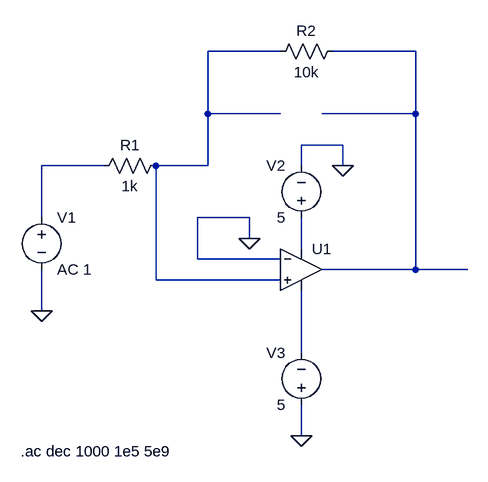
[diagram p0: schematic low-gain-amp-with-out_C_v3.asc]
low-gain-amp-with-out_C_v3.asc, the LTspice schematic file:
Version 4
SHEET 1 880 680
WIRE 272 -112 160 -112
WIRE 480 -112 352 -112
WIRE 160 -16 160 -112
WIRE 272 -16 160 -16
WIRE 480 -16 480 -112
WIRE 480 -16 336 -16
WIRE 368 32 304 32
WIRE 0 64 -96 64
WIRE 160 64 160 -16
WIRE 160 64 80 64
WIRE 304 64 304 32
WIRE 368 64 368 32
WIRE -96 144 -96 64
WIRE 224 144 144 144
WIRE 224 176 224 144
WIRE 304 192 304 144
WIRE 144 208 144 144
WIRE 272 208 144 208
WIRE 480 224 480 -16
WIRE 480 224 336 224
WIRE 560 224 480 224
WIRE 80 240 80 64
WIRE 272 240 80 240
WIRE -96 288 -96 224
WIRE 304 352 304 256
WIRE 304 480 304 432
FLAG 304 480 0
FLAG 368 64 0
FLAG 224 176 0
FLAG -96 288 0
SYMBOL voltage -96 128 R0
WINDOW 123 0 0 Left 0
WINDOW 39 0 0 Left 0
SYMATTR InstName V1
SYMATTR Value AC 1
SYMBOL res 96 48 R90
WINDOW 0 0 56 VBottom 2
WINDOW 3 32 56 VTop 2
SYMATTR InstName R1
SYMATTR Value 1k
SYMBOL res 368 -128 R90
WINDOW 0 0 56 VBottom 2
WINDOW 3 32 56 VTop 2
SYMATTR InstName R2
SYMATTR Value 10k
SYMBOL OpAmps\\UniversalOpAmp2 304 224 R0
SYMATTR InstName U1
SYMATTR Value2 Avol=1Meg GBW=100Meg Slew=10Meg
SYMBOL voltage 304 160 R180
WINDOW 0 24 96 Left 2
WINDOW 3 24 16 Left 2
WINDOW 123 0 0 Left 0
WINDOW 39 0 0 Left 0
SYMATTR InstName V2
SYMATTR Value 5
SYMBOL voltage 304 448 R180
WINDOW 0 24 96 Left 2
WINDOW 3 24 16 Left 2
WINDOW 123 0 0 Left 0
WINDOW 39 0 0 Left 0
SYMATTR InstName V3
SYMATTR Value 5
TEXT -128 504 Left 2 !.ac dec 1000 1e5 5e9

The netlist it stands for:
* low-gain-amp-with-out_C_v3.asc
V1 N003 0 AC 1
R1 N001 N003 1k
R2 N002 N001 10k
XU1 N001 0 N004 N005 N002 level2 Avol=1Meg GBW=100Meg Slew=10Meg Ilimit=25m Rail=0 Vos=0 En=0 Enk=0 In=0 Ink=0 Rin=500Meg  ; pins In+ In- V+ V- OUT
V2 N004 0 5
V3 0 N005 5
.ac dec 1000 1e5 5e9
.lib UniversalOpAmp2.lib
.backanno
.end